# Altium schematic sheet SH13 - OMAP-L137 CAPS.SchDoc
size 386 x 246 mm
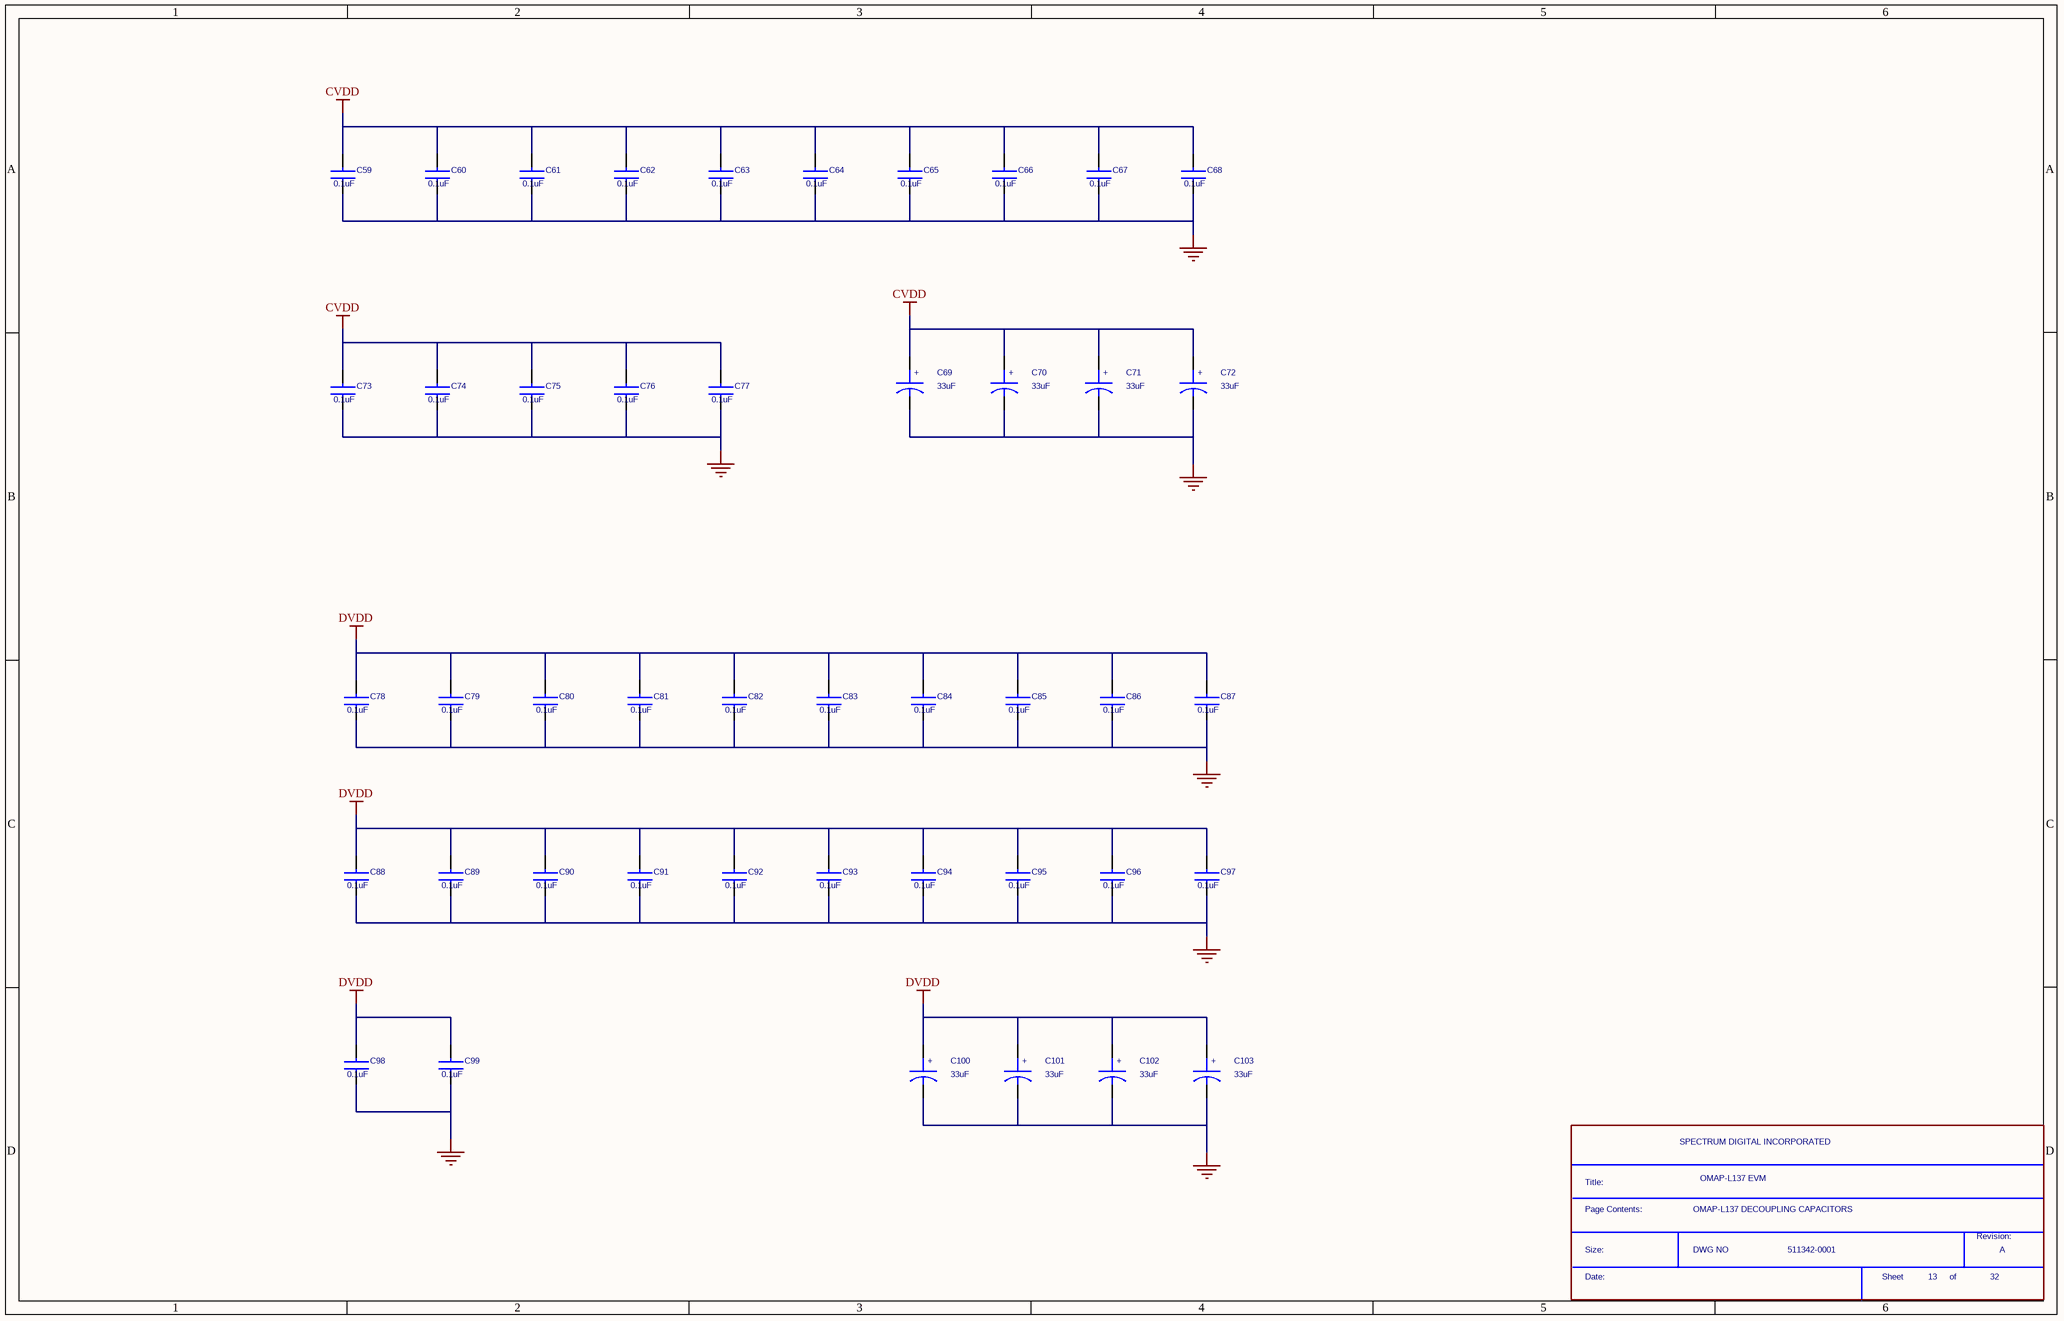
[diagram p0: SH13 - OMAP-L137 CAPS.SchDoc]

## Parts
*  Page Contents:: OMAP-L137 DECOUPLING CAPACITORS  RevCode: A  Title: OMAP-L137 EVM  OrgName: SPECTRUM DIGITAL INCORPORATED  Doc: 511342-0001  Page Number: 13  Page Count: 32  (hidden comment: SDTitleBlock)  (graphical)
C59  0.1uF  [1206]
C60  0.1uF  [1206]
C61  0.1uF  [1206]
C62  0.1uF  [1206]
C63  0.1uF  [1206]
C64  0.1uF  [1206]
C65  0.1uF  [1206]
C66  0.1uF  [1206]
C67  0.1uF  [1206]
C68  0.1uF  [1206]
C69  33uF  [c1206-40x70p]
C70  33uF  [c1206-40x70p]
C71  33uF  [c1206-40x70p]
C72  33uF  [c1206-40x70p]
C73  0.1uF  [1206]
C74  0.1uF  [1206]
C75  0.1uF  [1206]
C76  0.1uF  [1206]
C77  0.1uF  [1206]
C78  0.1uF  [1206]
C79  0.1uF  [1206]
C80  0.1uF  [1206]
C81  0.1uF  [1206]
C82  0.1uF  [1206]
C83  0.1uF  [1206]
C84  0.1uF  [1206]
C85  0.1uF  [1206]
C86  0.1uF  [1206]
C87  0.1uF  [1206]
C88  0.1uF  [1206]
C89  0.1uF  [1206]
C90  0.1uF  [1206]
C91  0.1uF  [1206]
C92  0.1uF  [1206]
C93  0.1uF  [1206]
C94  0.1uF  [1206]
C95  0.1uF  [1206]
C96  0.1uF  [1206]
C97  0.1uF  [1206]
C98  0.1uF  [1206]
C99  0.1uF  [1206]
C100  33uF  [c1206-40x70p]
C101  33uF  [c1206-40x70p]
C102  33uF  [c1206-40x70p]
C103  33uF  [c1206-40x70p]

## Nets
CVDD: C59.2 C60.2 C61.2 C62.2 C63.2 C64.2 C65.2 C66.2 C67.2 C68.2 C69.1(ANODE) C70.1(ANODE) C71.1(ANODE) C72.1(ANODE) C73.2 C74.2 C75.2 C76.2 C77.2
DVDD: C78.2 C79.2 C80.2 C81.2 C82.2 C83.2 C84.2 C85.2 C86.2 C87.2 C88.2 C89.2 C90.2 C91.2 C92.2 C93.2 C94.2 C95.2 C96.2 C97.2 C98.2 C99.2 C100.1(ANODE) C101.1(ANODE) C102.1(ANODE) C103.1(ANODE)
GND: C59.1 C60.1 C61.1 C62.1 C63.1 C64.1 C65.1 C66.1 C67.1 C68.1 C69.2(CATHODE) C70.2(CATHODE) C71.2(CATHODE) C72.2(CATHODE) C73.1 C74.1 C75.1 C76.1 C77.1 C78.1 C79.1 C80.1 C81.1 C82.1 C83.1 C84.1 C85.1 C86.1 C87.1 C88.1 C89.1 C90.1 C91.1 C92.1 C93.1 C94.1 C95.1 C96.1 C97.1 C98.1 C99.1 C100.2(CATHODE) C101.2(CATHODE) C102.2(CATHODE) C103.2(CATHODE)

## Notes on the sheet
- (in symbol CAP P) +
- (in symbol SDTitleBlock) Title:; Page Contents:; Revision:; Size:; DWG NO; Date:; Sheet; of

## Library data of the parts
C59-C68 C73-C99 = NPCap_0: Part #: 101587-1100R; SD PCB Footprint: EIA0603
C69-C72 C100-C102 = CAP P: Part #: 101953-0331R; Spectrum Part#: 101347-0102
C103 = CAP P: Spectrum Part#: 101347-0102; Part #: 101953-0331R